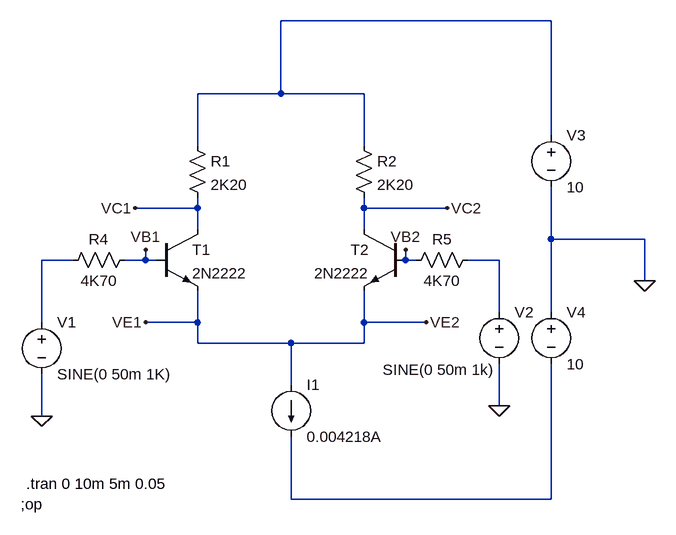
[diagram p0: schematic diff_amp_task1.asc]
diff_amp_task1.asc, the LTspice schematic file:
Version 4
SHEET 1 880 680
WIRE 688 -192 272 -192
WIRE 272 -80 272 -192
WIRE 272 -80 144 -80
WIRE 400 -80 272 -80
WIRE 688 -16 688 -192
WIRE 144 0 144 -80
WIRE 400 0 400 -80
WIRE 144 96 144 80
WIRE 144 96 48 96
WIRE 400 96 400 80
WIRE 528 96 400 96
WIRE 144 128 144 96
WIRE 400 128 400 96
WIRE 688 144 688 64
WIRE 832 144 688 144
WIRE -48 176 -96 176
WIRE 64 176 64 160
WIRE 64 176 32 176
WIRE 80 176 64 176
WIRE 464 176 464 160
WIRE 480 176 464 176
WIRE 608 176 560 176
WIRE 832 208 832 144
WIRE 608 256 608 176
WIRE 688 256 688 144
WIRE -96 272 -96 176
WIRE 144 272 144 224
WIRE 144 272 64 272
WIRE 400 272 400 224
WIRE 496 272 400 272
WIRE 144 304 144 272
WIRE 288 304 144 304
WIRE 400 304 400 272
WIRE 400 304 288 304
WIRE 288 368 288 304
WIRE 608 400 608 336
WIRE -96 416 -96 352
WIRE 288 544 288 448
WIRE 688 544 688 336
WIRE 688 544 288 544
FLAG 832 208 0
FLAG -96 416 0
FLAG 608 400 0
FLAG 48 96 VC1
FLAG 528 96 VC2
FLAG 64 272 VE1
FLAG 64 160 VB1
FLAG 464 160 VB2
FLAG 496 272 VE2
SYMBOL npn 80 128 R0
SYMATTR InstName T1
SYMATTR Value 2N2222
SYMBOL npn 464 128 M0
SYMATTR InstName T2
SYMATTR Value 2N2222
SYMBOL res 128 -16 R0
SYMATTR InstName R1
SYMATTR Value 2K20
SYMBOL res 384 -16 R0
SYMATTR InstName R2
SYMATTR Value 2K20
SYMBOL res 48 160 R90
WINDOW 0 0 56 VBottom 2
WINDOW 3 32 56 VTop 2
SYMATTR InstName R4
SYMATTR Value 4K70
SYMBOL res 576 160 R90
WINDOW 0 0 56 VBottom 2
WINDOW 3 32 56 VTop 2
SYMATTR InstName R5
SYMATTR Value 4K70
SYMBOL voltage 688 240 R0
SYMATTR InstName V4
SYMATTR Value 10
SYMBOL voltage 688 -32 R0
SYMATTR InstName V3
SYMATTR Value 10
SYMBOL voltage -96 256 R0
WINDOW 123 0 0 Left 0
WINDOW 39 0 0 Left 0
SYMATTR InstName V1
SYMATTR Value SINE(0 50m 1K)
SYMBOL voltage 608 240 R0
WINDOW 123 0 0 Left 0
WINDOW 39 0 0 Left 0
WINDOW 3 -179 105 Left 2
SYMATTR InstName V2
SYMATTR Value SINE(0 50m 1k)
SYMBOL current 288 368 R0
WINDOW 123 0 0 Left 0
WINDOW 39 0 0 Left 0
SYMATTR InstName I1
SYMATTR Value 0.004218A
TEXT -128 552 Left 2 !;op
TEXT -120 520 Left 2 !.tran 0 10m 5m 0.05

The netlist it stands for:
* diff_amp_task1.asc
Q§T1 VC1 VB1 VE2 0 2N2222
Q§T2 VC2 VB2 VE2 0 2N2222
R1 N001 VC1 2K20
R2 N001 VC2 2K20
R4 VB1 N002 4K70
R5 N003 VB2 4K70
V4 0 N004 10
V3 N001 0 10
V1 N002 0 SINE(0 50m 1K)
V2 N003 0 SINE(0 50m 1k)
I1 VE2 N004 0.004218A
.model NPN NPN
.model PNP PNP
.lib standard.bjt
;op
.tran 0 10m 5m 0.05
.backanno
.end